# EAGLE design receiver (EAGLE 6.3)
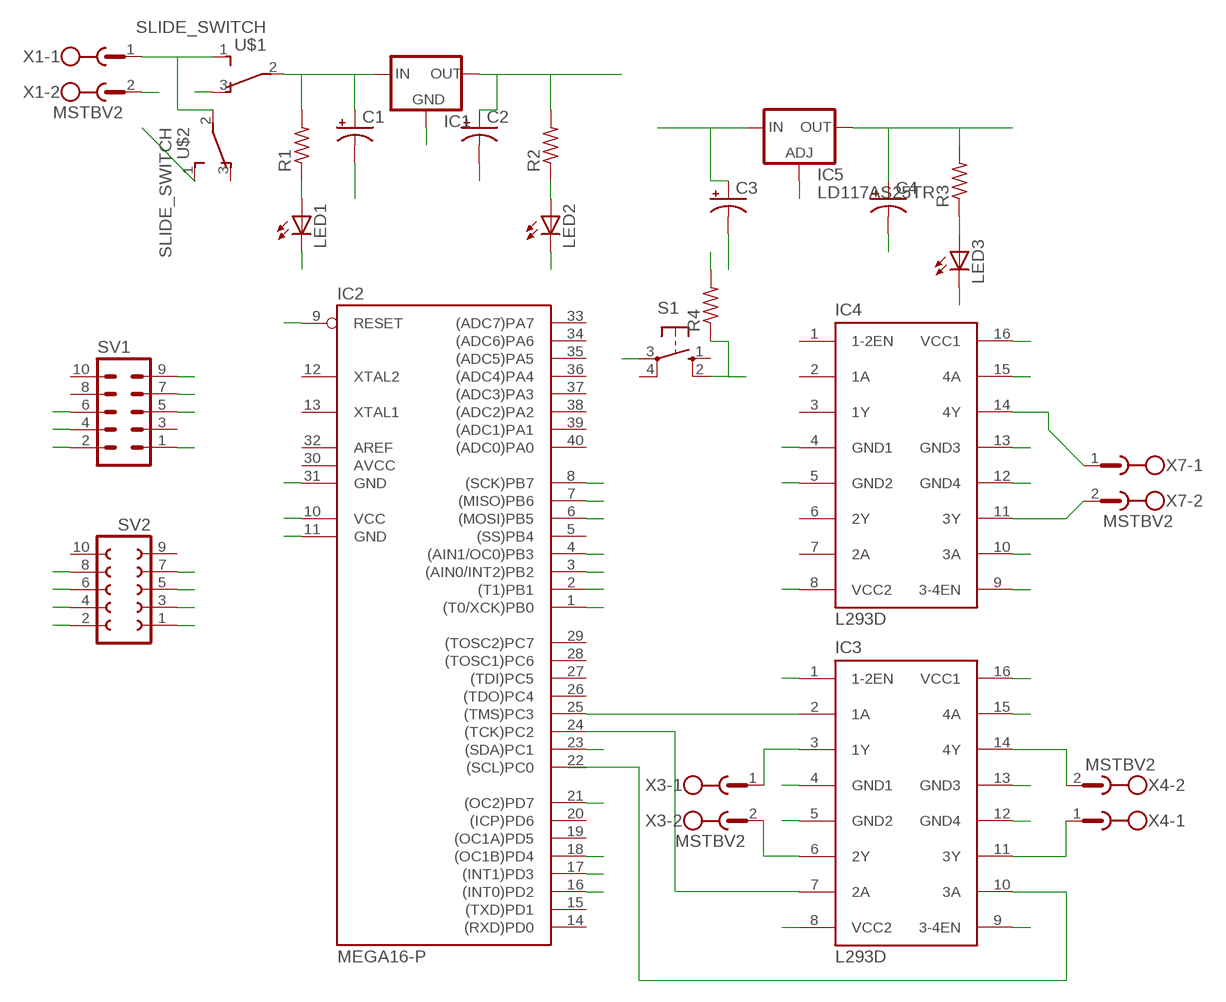
[diagram p0: schematic, sheet 1]

## Parts
C1  CPOL-USE2.5-6  [E2,5-6]
C2  CPOL-USE2.5-6  [E2,5-6]
C3  CPOL-USE2.5-6  [E2,5-6]
C4  CPOL-USE2.5-6  [E2,5-6]
IC1  78XXS  [78XXS]
IC2  MEGA16-P  [DIL40]
IC3  L293D  [DIL16]
IC4  L293D  [DIL16]
IC5  LD117AS25TR  [SOT223]
LED1  LED3MM  [LED3MM]
LED2  LED3MM  [LED3MM]
LED3  LED3MM  [LED3MM]
R1  R-US_0207/10  [0207/10]
R2  R-US_0207/10  [0207/10]
R3  R-US_0207/10  [0207/10]
R4  R-US_0207/10  [0207/10]
S1  10-XX  [B3F-10XX]
SV1  ML10  [ML10]
SV2  FE05-2  [FE05-2]
U$1  SLIDE_SWITCH  [SPDT]
U$2  SLIDE_SWITCH  [SPDT]
X1  MSTBV2  [MSTBV2]
X3  MSTBV2  [MSTBV2]
X4  MSTBV2  [MSTBV2]
X7  MSTBV2  [MSTBV2]

## Nets
16: IC2.16((INT0)PD2) IC4.15(4A)
17: IC2.17((INT1)PD3) IC4.10(3A)
23: IC2.23((SDA)PC1) IC3.15(4A)
CE: IC2.1((T0/XCK)PB0) SV2.3
CSN: IC2.2((T1)PB1) SV2.4
EN12: IC2.4((AIN1/OC0)PB3) IC3.1(1-2EN)
EN34: IC2.21((OC2)PD7) IC3.9(3-4EN)
GND: C1.- C2.- C3.- C4.- IC1.GND IC2.11(GND) IC2.31(GND) IC3.4(GND1) IC3.5(GND2) IC3.12(GND4) IC3.13(GND3) IC4.4(GND1) IC4.5(GND2) IC4.12(GND4) IC4.13(GND3) IC5.1(ADJ) LED1.K(C) LED2.K(C) LED3.K(C) S1.3(P) SV1.4 SV1.6 SV2.1 U$1.3(NC) X1.2
IRQ: IC2.3((AIN0/INT2)PB2) SV2.8
MISO: IC2.7((MISO)PB6) SV1.9 SV2.7
MOSI: IC2.6((MOSI)PB5) SV1.1 SV2.6
N$1: U$1.1(NO) U$2.2(P) X1.1
N$3: C1.+ IC1.IN R1.2 U$1.2(P)
N$4: LED1.A R1.1
N$5: IC4.14(4Y) X7.1
N$6: LED2.A R2.1
N$7: IC2.25((TMS)PC3) IC3.2(1A)
N$8: IC4.11(3Y) X7.2
N$9: IC2.24((TCK)PC2) IC3.7(2A)
N$10: IC3.14(4Y) X4.2
N$11: IC2.22((SCL)PC0) IC3.10(3A)
N$12: IC3.11(3Y) X4.1
N$13: IC3.3(1Y) X3.1
N$14: IC3.6(2Y) X3.2
N$19: LED3.A R3.1
OC1B: IC2.18((OC1B)PD4) IC4.9(3-4EN)
RST: IC2.9(RESET) R4.1 S1.2(S1) SV1.5
SCK: IC2.8((SCK)PB7) SV1.7 SV2.5
VCC: C2.+ C3.+ IC1.OUT IC2.10(VCC) IC3.16(VCC1) IC4.16(VCC1) IC5.3(IN) R2.2 R4.2 SV1.2
VCC3.3: C4.+ IC5.4(OUT) R3.2 SV2.2
VCC12: IC3.8(VCC2) IC4.8(VCC2) U$2.1(NO)
Unconnected: IC2.5((SS)PB4) IC2.12(XTAL2) IC2.13(XTAL1) IC2.14((RXD)PD0) IC2.15((TXD)PD1) IC2.19((OC1A)PD5) IC2.20((ICP)PD6) IC2.26((TDO)PC4) IC2.27((TDI)PC5) IC2.28((TOSC1)PC6) IC2.29((TOSC2)PC7) IC2.32(AREF) IC2.33((ADC7)PA7) IC2.34((ADC6)PA6) IC2.35((ADC5)PA5) IC2.36((ADC4)PA4) IC2.37((ADC3)PA3) IC2.38((ADC2)PA2) IC2.39((ADC1)PA1) IC2.40((ADC0)PA0) IC4.1(1-2EN) IC4.2(1A) IC4.3(1Y) IC4.6(2Y) IC4.7(2A) S1.1(S) S1.4(P1) SV1.3 SV1.8 SV1.10 SV2.9 SV2.10 U$2.3(NC)

## Power pins joined to a net without a drawn wire
AVCC: IC2.30(AVCC)

## Library data of the parts
C1-C4 = rcl:CPOL-US: POLARIZED CAPACITOR, American symbol
IC1 = v-reg:78XXS: VOLTAGE REGULATOR
IC2 = atmel:MEGA16-P: MICROCONTROLLER 16 Kbytes FLASH 1 kbytes SRAM 512 bytes EEPROM USART 8-channel 10 bit ADC Source: avr.lbr; MPN: ATMEGA16-16PU; OC_FARNELL: 9171142; OC_NEWARK: 01M6885
IC3 IC4 = st-microelectronics:L293D: PUSH-PULL 4 CHANNEL DRIVER; MPN: L293D; OC_FARNELL: 9589619; OC_NEWARK: 56P8249
IC5 = v-reg:LD117A?*: Low drop fixed and adjustable positive voltage regulators 1 A Source: http://www.st.com/stonline/products/literature/ds/7194/ld1117axx.pdf
LED1-LED3 = adafruit:LED: LED OSRAM: - CHIPLED LG R971, LG N971, LY N971, LG Q971, LY Q971, LO R971, LY R971 LH N974, LH R974 LS Q976, LO Q976, LY Q976 LO Q996 - Hyper CHIPLED LW Q18S LB Q993, LB Q99A, LB R99A - SideLED LS A670, LO A670, LY A670, LG A670, LP A670 LB A673, LV A673, LT A673, LW A673 LH A674 LY A675 LS A676, LA A676, LO A676, LY A676, LW A676 LS A679, LY A679, LG A679 - Hyper Micro SIDELED® LS Y876, LA Y876, LO Y876, LY Y876 LT Y87S - SmartLED LW L88C, LW L88S LB L89C, LB L89S, LG L890 LS L89K, LO L89K, LY L89K LS L896, LA L896, LO L896, LY L896 - TOPLED LS T670, LO T670, LY T670, LG T670, LP T670 LSG T670, LSP T670, LSY T670, LOP T670, LYG T670 LG T671, LOG T671, LSG T671 LB T673, LV T673, LT T673, LW T673 LH T674 LS T676, LA T676, LO T676, LY T676, LB T676, LH T676, LSB T676, LW T676 LB T67C, LV T67C, LT T67C, LS T67K, LO T67K, LY T67K, LW E67C LS E67B, LA E67B, LO E67B, LY E67B, LB E67C, LV E67C, LT E67C LW T67C LS T679, LY T679, LG T679 LS T770, LO T770, LY T770, LG T770, LP T770 LB T773, LV T773, LT T773, LW T773 LH T774 LS E675, LA E675, LY E675, LS T675 LS T776, LA T776, LO T776, LY T776, LB T776 LHGB T686 LT T68C, LB T68C - Hyper Mini TOPLED® LB M676 - Mini TOPLED Santana® LG M470 LS M47K, LO M47K, LY M47K Source: http://www.osram.convergy.de/
R1-R4 = rcl:R-US_: RESISTOR, American symbol
S1 = switch-omron:10-XX: OMRON SWITCH; MPN: B3F-1000; OC_FARNELL: 176432; OC_NEWARK: 36M3542
SV1 = con-harting-ml:ML10: HARTING; OC_FARNELL: unknown; OC_NEWARK: unknown
SV2 = con-lsta:FE05-2: FEMALE HEADER; OC_FARNELL: unknown; OC_NEWARK: unknown
U$1 U$2 = RSC:SLIDE_SWITCH
X1 X3 X4 X7 = con-phoenix-508:MSTBV2: PHOENIX; MPN: MSTBV 2,5/2-GF-5.08; OC_FARNELL: 1792792; OC_NEWARK: 69R9845

## Board
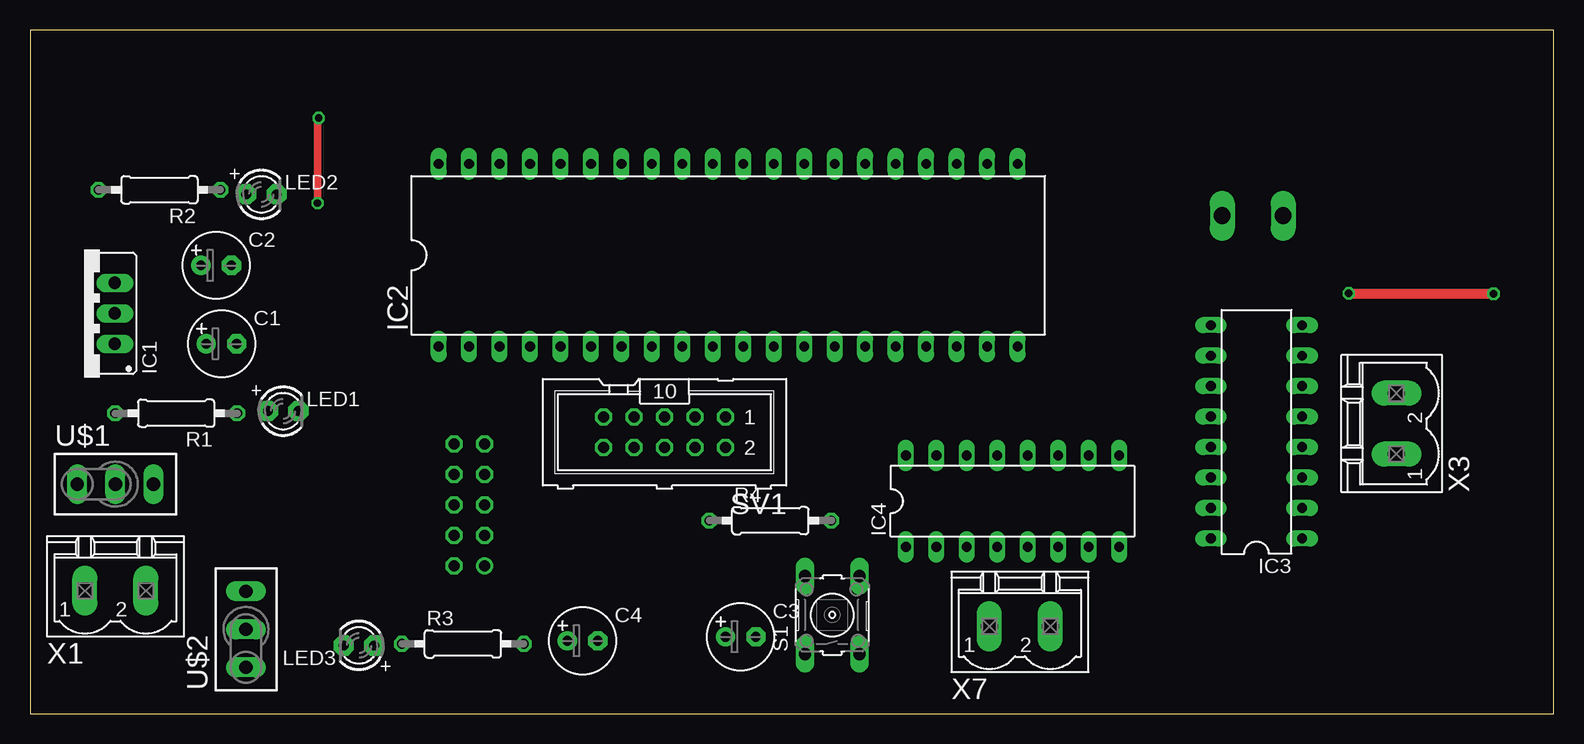
[diagram p1: board, top side]
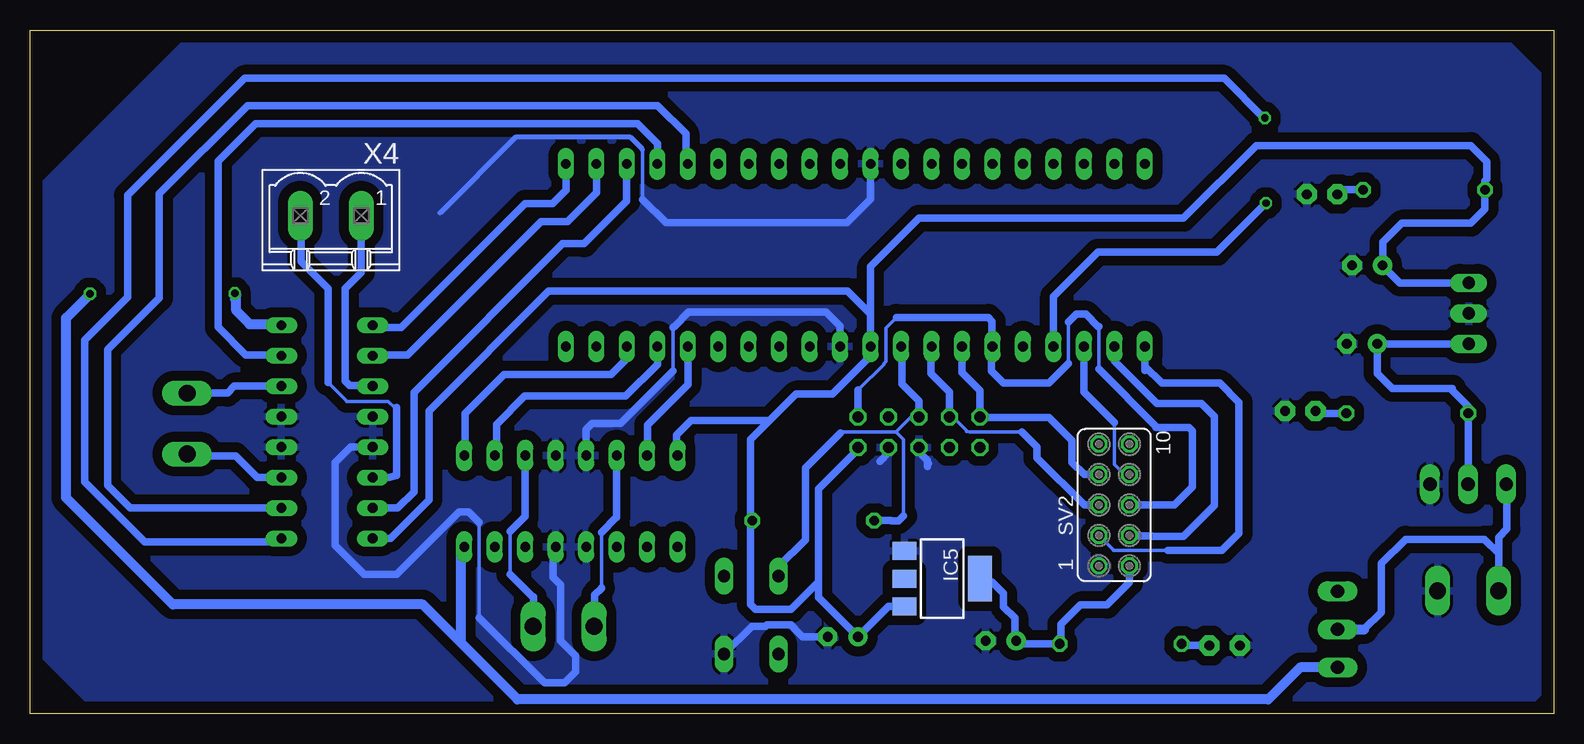
[diagram p2: board, bottom side, seen from below]

Size 127 x 57 mm. Coordinates in mm from the lower left corner, seen from the top.
Outline: 0,0 127,0 127,57 0,57 0,0
Copper layers (1*16): Top 0.035mm / dielectric 1.5mm / Bottom 0.035mm
Design rules "default": minimum track width 10mil, minimum drill 24mil, track to track 8mil, track to pad 8mil, pad to pad 8mil, via to via 8mil, smd to smd 8mil, copper to edge 40mil, drill to drill 8mil, minimum pad ring 10mil, minimum via ring 8mil, stop-mask expansion 4mil, vias tented up to drill 0mil, thermal gap 10mil

### Footprints (pad centres in the part's own frame; a part is rotated, then mirrored left to right if it is on the bottom)
E2,5-6 = drill 0.813 pad 1.6: + -1.27,0 | drill 0.813 pad 1.6 octagon: - 1.27,0
78XXS = drill 1.016 long: GND 0,-2.54; IN -2.54,-2.54; OUT 2.54,-2.54
DIL40 = drill 0.813 long: 1 -24.13,-7.62; 2 -21.59,-7.62; 3 -19.05,-7.62; 4 -16.51,-7.62; 5 -13.97,-7.62; 6 -11.43,-7.62; 7 -8.89,-7.62; 8 -6.35,-7.62; 9 -3.81,-7.62; 10 -1.27,-7.62; 11 1.27,-7.62; 12 3.81,-7.62; 13 6.35,-7.62; 14 8.89,-7.62; 15 11.43,-7.62; 16 13.97,-7.62; 17 16.51,-7.62; 18 19.05,-7.62; 19 21.59,-7.62; 20 24.13,-7.62; 21 24.13,7.62; 22 21.59,7.62; 23 19.05,7.62; 24 16.51,7.62; 25 13.97,7.62; 26 11.43,7.62; 27 8.89,7.62; 28 6.35,7.62; 29 3.81,7.62; 30 1.27,7.62; 31 -1.27,7.62; 32 -3.81,7.62; 33 -6.35,7.62; 34 -8.89,7.62; 35 -11.43,7.62; 36 -13.97,7.62; 37 -16.51,7.62; 38 -19.05,7.62; 39 -21.59,7.62; 40 -24.13,7.62
DIL16 = drill 0.813 long: 1 -8.89,-3.81; 2 -6.35,-3.81; 3 -3.81,-3.81; 4 -1.27,-3.81; 5 1.27,-3.81; 6 3.81,-3.81; 7 6.35,-3.81; 8 8.89,-3.81; 9 8.89,3.81; 10 6.35,3.81; 11 3.81,3.81; 12 1.27,3.81; 13 -1.27,3.81; 14 -3.81,3.81; 15 -6.35,3.81; 16 -8.89,3.81
SOT223 = smd 1.5 x 2: 1 -2.3,-3.15; 2 0,-3.15; 3 2.3,-3.15 | smd 3.8 x 2: 4 0,3.15
LED3MM = drill 0.813 pad 1.676 octagon: A -1.27,0; K 1.27,0
0207/10 = drill 0.813 octagon: 1 -5.08,0; 2 5.08,0
B3F-10XX = drill 1.016 long: 1 -3.251,2.261; 2 3.251,2.261; 3 -3.251,-2.261; 4 3.251,-2.261
ML10 = drill 0.914 octagon: 1 -5.08,-1.27; 2 -5.08,1.27; 3 -2.54,-1.27; 4 -2.54,1.27; 5 0,-1.27; 6 0,1.27; 7 2.54,-1.27; 8 2.54,1.27; 9 5.08,-1.27; 10 5.08,1.27
FE05-2 = drill 0.914: 1 -5.08,1.27 | drill 0.914 octagon: 2 -5.08,-1.27; 3 -2.54,1.27; 4 -2.54,-1.27; 5 0,1.27; 6 0,-1.27; 7 2.54,1.27; 8 2.54,-1.27; 9 5.08,1.27; 10 5.08,-1.27
SPDT = drill 1.1 pad 1.422 long: 1 -3.175,0; 2 0,0; 3 3.175,0
MSTBV2 = drill 1.397 long: 1 -2.54,0; 2 2.54,0

### Placement (x,y rotation side)
C1  15.96,30.83 0 top
C2  15.52,37.37 0 top
C3  59.24,6.4 0 top
C4  46.06,6.06 0 top
IC1  4.53,33.37 90 top
IC2  58.19,38.22 0 top
IC3  102.24,23.49 90 top
IC4  81.9,17.71 0 top
IC5  50.95,11.25 270 bottom
LED1  21.1,25.23 0 top
LED2  19.29,43.3 0 top
LED3  27.42,5.67 180 top
R1  12.18,25.04 180 top
R2  10.79,43.67 180 top
R3  36.08,5.81 0 top
R4  61.71,16.09 0 top
S1  66.87,8.21 90 top
SV1  52.89,23.46 180 top
SV2  36.61,17.38 90 bottom
U$1  7.12,19.13 0 top
U$2  18,7.02 90 top
X1  7.12,10.24 0 top
X3  113.9,24.18 90 top
X4  101.92,41.51 180 bottom
X7  82.52,7.27 0 top

### Tracks (layer width: path | path; a pad name or v marks a point on that pad's centre or on a via)
16
  Bottom 0.61: IC2.16 72.16,27.42 75.51,24.08 75.51,21.56 IC4.15
17
  Bottom 0.61: IC2.17 74.7,29.12 77.34,26.48 85.76,26.48 88.12,24.12 88.12,21.66 IC4.10
23
  Bottom 0.61: IC3.15 96.35,17.14 95,18.49 95,26.76 82.58,39.17 80.81,39.17 80.68,39.3 77.27,42.71 77.27,45.81 IC2.23
CE
  Bottom 0.305: 32.15,13.61 36.7,13.61 36.7,13.66 SV2.3
  Bottom 0.61: IC2.1 34.06,28.95 | 34.06,28.95 34.06,28.59 | 32.15,13.61 32.14,13.61 27.63,13.61 26.22,15.01 26.22,25.94 27.83,27.55 32.66,27.55 34.06,28.95
CSN
  Bottom 0.61: IC2.2 36.6,29.39 33.06,25.84 29.37,25.84 28.28,24.75 28.28,17.36 30.84,14.79 33.48,14.79 33.49,14.79 35.29,14.79 SV2.4
EN12  (via drill 0.6)
  Top 0.61: v23.96,42.57 23.96,49.56 v24.06,49.66
  Bottom 0.61: IC2.4 41.68,34.78 37.99,38.47 28.06,38.47 v23.96,42.57 | IC3.1 106.33,14.32 117.44,14.32 122.43,19.31 122.43,31.14 118.86,34.72 118.86,43.21 109.1,52.96 27.46,52.96 24.16,49.66 v24.06,49.66
EN34
  Bottom 0.61: IC2.21 82.32,43.66 83.45,42.53 85.73,42.53 96.07,32.19 98.24,32.19 IC3.9
GND
  Bottom 0.305: 73.39,32.2 73.39,28.54 | 89.56,15.94 89.56,7.99 | 75.96,42.86 75.96,47
  Bottom 0.406: 92.83,41.75 86.52,48.06 76.95,48.06 75.96,47.06 75.96,47
  Bottom 0.61: IC2.11 59.46,32.29 60.64,33.47 72.1,33.47 73.27,32.29 73.3,32.29 73.39,32.2 | 73.39,28.54 77.76,24.18 80.16,24.18 80.63,23.7 IC4.13 | C3.- 62.59,6.4 63.27,7.08 63.27,7.1 63.57,7.4 65.57,7.4 65.68,7.29 66.81,7.29 S1.3 | SV1.6 52.89,21.82 52.19,21.12 52.19,20.76 | 52.19,20.62 52.19,20.76 | 52.19,20.76 52.09,20.86 | SV1.4 55.43,21.76 56.16,21.03 | IC3.13 100.27,22.22 101.54,20.95 101.54,14.01 99.14,11.61 96.44,11.61 91.24,16.8 90.43,16.8 89.56,15.94 | 89.56,7.99 84.12,2.55 82.44,2.55 81.52,3.47 81.52,4.82 82.77,6.07 82.77,10.74 83.4,11.36 83.4,13.67 IC4.5 | IC2.31 56.92,42.91 58.91,40.93 73.97,40.93 75.96,42.86
  pour Bottom (isolate 0.813): -4,38 -4,48 4,56 114,56 127,43 127,6 118,-3 6,-3 -4,7
IRQ
  Bottom 0.305: 36.62,24.27 36.62,20.77 35.77,19.92 SV2.8
  Bottom 0.61: IC2.3 39.14,26.8 36.62,24.27
MISO
  Bottom 0.61: IC2.7 49.3,28.43 47.81,26.94 SV1.9 47.78,24.7 42.06,24.7 40.14,22.78 40.14,20.95 39.11,19.92 SV2.7
MOSI
  Bottom 0.305: 57.97,26.98 55.82,29.12 55.82,29.19 55.66,29.36 55.66,32.14 54.78,33.02 | 37.89,28.72 37.89,32.29 | 40.42,32.65 40.42,29.18
  Bottom 0.61: SV1.1 57.97,26.98 | 54.78,33.02 47.12,33.02 46.8,32.7 46.8,30.63 IC2.6 46.87,30.49 46.87,28.55 45.86,27.54 42.06,27.54 40.42,29.18 | 40.42,32.65 39.78,33.29 38.98,33.29 37.98,32.29 37.89,32.29 | SV2.6 34.35,17.38 31.62,17.38 30.1,18.9 30.1,23.57 30.4,23.87 33.13,23.87 33.13,23.95 37.89,28.72
N$1
  Bottom 0.61: X1.1 4.58,13.34 | 4.58,13.34 4.58,14.67 3.88,15.38 3.88,19.05 U$1.1 | 15.81,7.02 14.37,8.46 14.37,12.5 12.33,14.54 5.79,14.54 4.58,13.34
  Bottom 0.813: U$2.2 15.81,7.02
N$3
  Bottom 0.61: 8.42,27.1 8.61,27.1 | 8.61,27.1 13.43,27.1 14.69,28.36 C1.+ IC1.IN | U$1.2 7.12,24.43 R1.2 7.1,25.6 8.61,27.1
N$4
  Bottom 0.61: R1.1 19.65,25.04 LED1.A
N$5
  Bottom 0.305: 79.37,15.11 79.37,10.49
  Bottom 0.61: IC4.14 78.09,16.34 78.14,16.34 79.37,15.11 | X7.1 79.92,7.33 79.92,9.89 79.37,10.44 79.37,10.49
N$6
  Bottom 0.61: R2.1 17.65,43.67 LED2.A
N$7
  Bottom 0.61: IC3.2 118.63,17.14 120.5,19.02 120.5,30.34 116.21,34.63 116.21,43.34 108.85,50.7 74.69,50.7 72.33,48.35 72.33,46.01 IC2.25
N$8
  Bottom 0.305: 86.98,15.2 86.98,11.62 86.98,11.49
  Bottom 0.61: IC4.11 85.71,16.44 85.74,16.44 86.98,15.2 | X7.2 85.03,7.29 85.03,9.73 85.09,9.73 86.98,11.62
N$9
  Bottom 0.61: IC3.7 106.11,29.9 109,29.9 111.31,32.21 111.31,45.26 111.32,45.27 111.32,46.05 108.18,49.19 76.37,49.19 74.7,47.52 IC2.24
N$10
  Bottom 0.305: 96.43,25.5 96.61,25.5 97.13,26.02 100.62,26.02 100.62,26.07 102.17,27.62
  Bottom 0.61: IC3.14 97.07,19.68 96.43,19.86 96.43,25.5 | X4.2 104.42,41.46 104.42,37.7 102.17,35.45 102.17,27.62
N$11
  Bottom 0.61: IC2.22 79.78,43.44 82.2,41.03 84.4,41.03 95.53,29.9 98.37,29.9 IC3.10
N$12
  Bottom 0.61: X4.1 99.38,36.78 100.72,35.44 100.72,27.74 100.34,27.35 98.48,27.35 IC3.11
N$13
  Bottom 0.61: IC3.3 108.07,19.68 109.87,21.48 113.75,21.48 X3.1
N$14
  Bottom 0.61: IC3.6 109.96,27.3 110.54,26.73 X3.2
N$19
  Bottom 0.61: LED3.A 30.87,5.67 R3.1
OC1B
  Bottom 0.61: IC2.18 77.24,29.59 78.55,28.28 87.47,28.28 90.72,25.04 90.72,21.59 IC4.9
RST
  Bottom 0.305: SV1.5 53.56,24.73 54.81,23.48 | 54.81,23.48 59.35,23.48 59.43,23.4 | 54.18,16.5 54.18,22.85 54.81,23.48 | 55.21,16.07 55.22,16.09
  Bottom 0.61: SV1.5 52.89,26.05 54.31,27.48 54.31,30.53 IC2.9 | S1.2 64.61,12.25 62.37,14.49 62.37,20.47 59.43,23.4 | 54.18,16.5 54.61,16.07 55.21,16.07 | 55.22,16.09 R4.1
SCK
  Bottom 0.305: 50.08,24.73 48.95,23.6 48.95,23.53 48.71,23.47 44.31,23.47
  Bottom 0.61: IC2.8 51.9,30.54 51.9,28.36 50.35,26.8 SV1.7 50.08,24.73 | SV2.5 39.12,17.38 43.07,21.33 43.07,22.23 44.31,23.47
VCC
  Bottom 0.61: 56.92,33.3 IC2.10 56.92,29.72 57.02,29.72 60.09,26.64 63.13,26.64 | 56.92,33.3 56.92,37.27 52.9,41.3 30.86,41.3 24.79,47.37 6.91,47.37 5.57,46.04 5.57,44.56 5.73,44.4 5.73,43.87 | IC3.16 96.95,14.6 93.74,17.82 93.74,25.24 83.76,35.22 58.84,35.22 56.92,33.3 | SV1.2 57.97,22.02 61.26,18.73 61.26,10.96 | 61.26,10.96 61.26,9.69 C3.+ 55.42,8.95 IC5.3 | 63.13,26.64 63.14,26.64 65.36,24.42 71.89,24.42 73.08,23.23 73.08,21.59 IC4.16 | 61.26,10.96 63.55,8.67 66.54,8.67 66.95,9.09 66.95,15.92 R4.2 66.93,16.22 66.93,22.84 63.13,26.64 | IC1.OUT 12.79,35.91 C2.+ 14.22,37.4 14.22,39.3 12.64,40.88 6.9,40.88 5.71,42.07 5.73,42.09 5.73,43.87 | R2.2 5.71,43.85 5.73,43.87
VCC3.3
  Bottom 0.61: IC5.4 47.55,11 46.83,11 45.83,10.01 45.83,8.9 44.91,7.98 44.91,6.18 C4.+ 44.54,5.81 R3.2 | 41.11,5.86 R3.2 | SV2.2 35.34,10.94 37.22,9.06 39.43,9.06 41.06,7.42 41.06,5.91 R3.2
VCC12  (via drill 0.6)
  Top 0.813: v122,35 110,35 v109.92,35.04
  Bottom 0.813: U$2.1 21.11,3.84 23.77,1.18 86.36,1.18 91.08,5.9 | 91.08,5.9 91.08,13.62 IC4.8 | 91.08,5.9 94.27,9.09 115.09,9.09 124,18 124,33 v122,35 | 109.92,34.59 v109.92,35.04 109.81,34.93 109.81,33.59 108.7,32.47 106.14,32.47 IC3.8